# EAGLE design RHD2132_headstage_accel_mini (EAGLE 8.3.2)
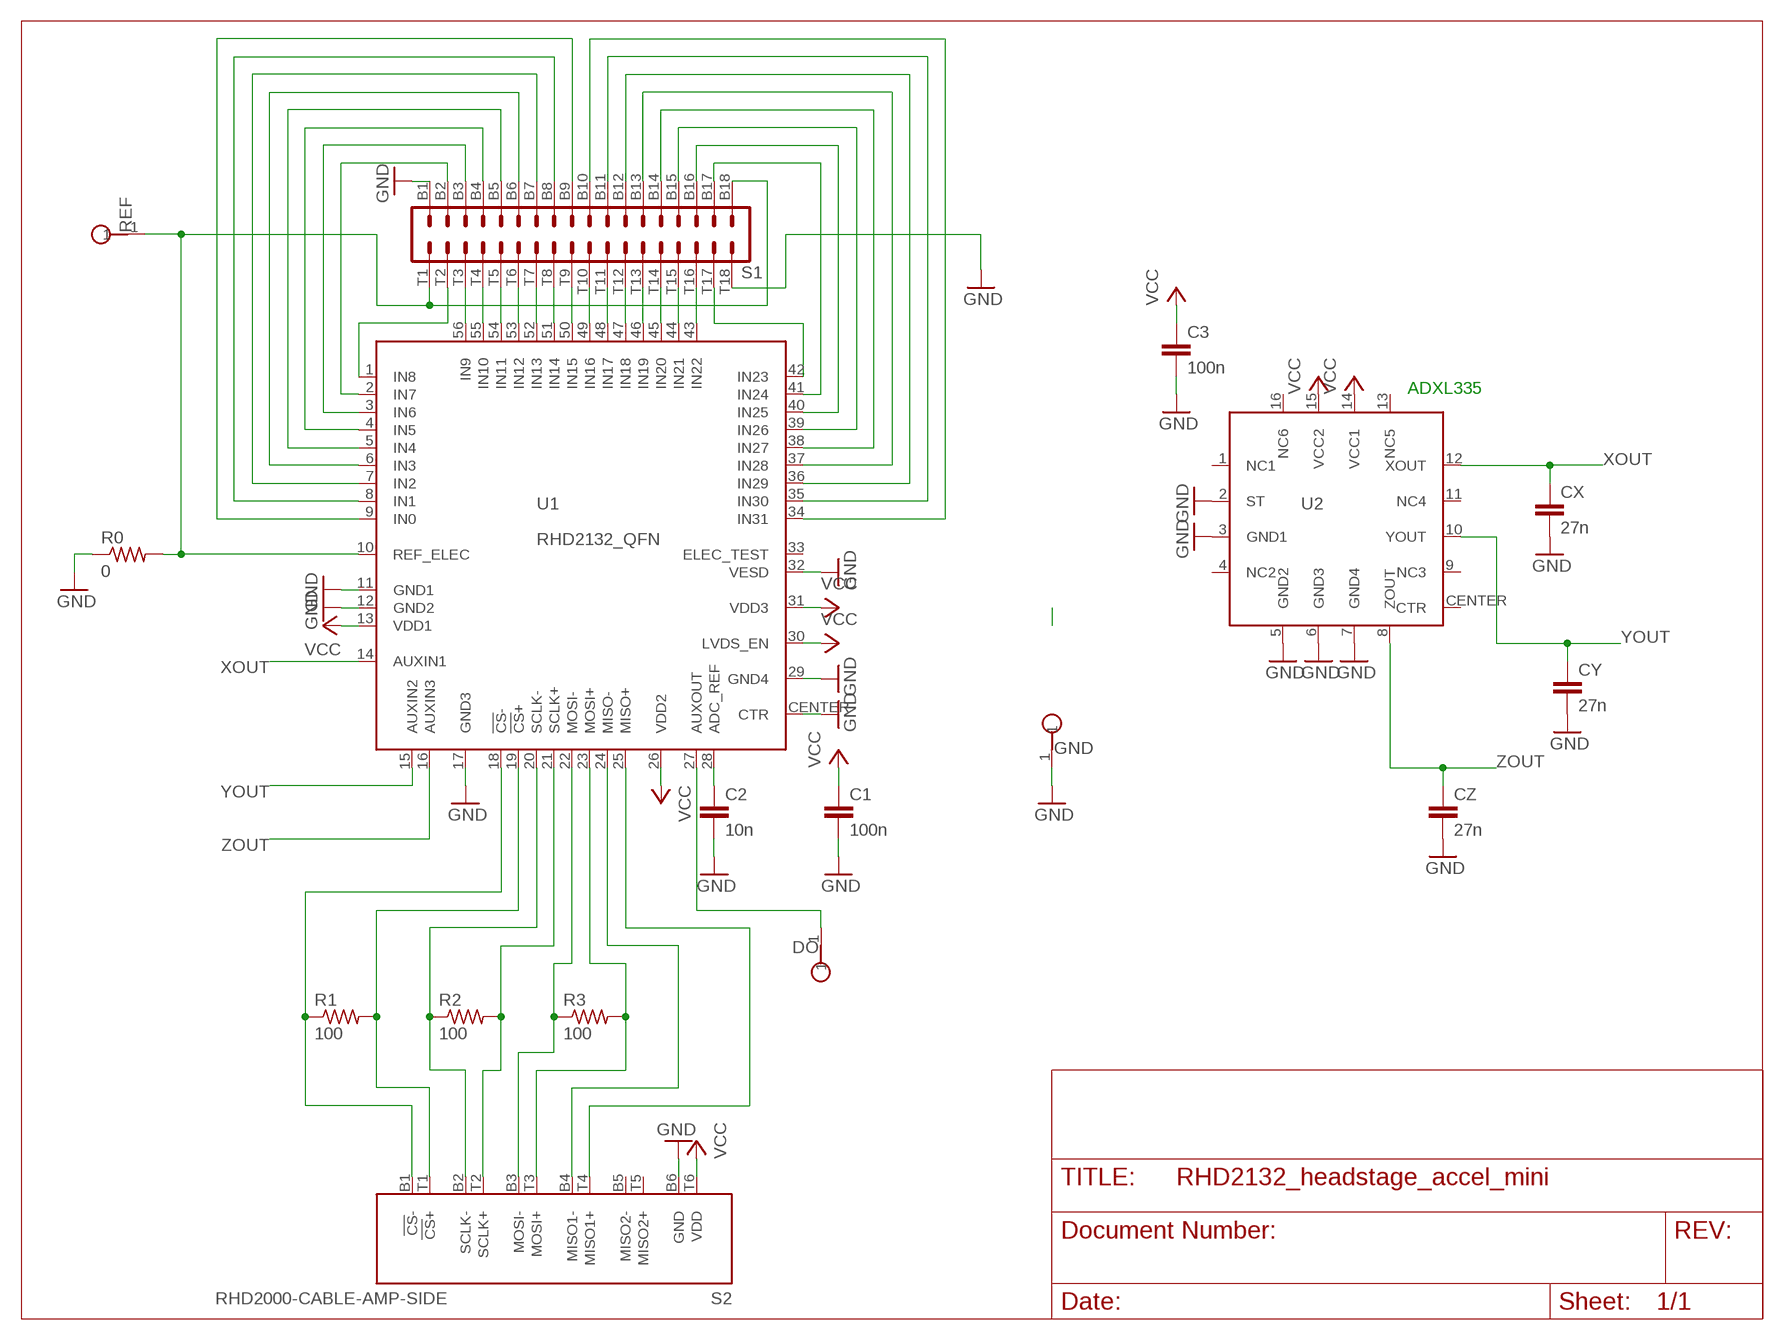
[diagram p0: schematic, sheet 1]

## Parts
C1  100n  C_0201  [0201]
C2  10n  C_0201  [0201]
C3  100n  C_0201  [0201]
CX  27n  C_0201  [0201]
CY  27n  C_0201  [0201]
CZ  27n  C_0201  [0201]
DO  TESTPOINT_SMALL  [TESTPOINT_SMALL]
GND  TESTPOINT_SMALL  [TESTPOINT_SMALL]
R0  0  R_0201  [0201]
R1  100  R_0201  [0201]
R2  100  R_0201  [0201]
R3  100  R_0201  [0201]
REF  TESTPOINT_SMALL  [TESTPOINT_SMALL]
S1  OMNETICS_A79025  [OMNETICS_A79025]
S2  RHD2000-CABLE-AMP-SIDE  [OMNETICS_PZN-12-AA]
U1  RHD2132_QFN  [QFN56_8_X_8_LARGE]
U2  ADXL335  [ADXL335]

## Nets
GND: C1.2 C2.2 C3.2 CX.2 CY.2 CZ.2 GND.1 R0.1 S1.B1 S1.T18 S2.B6(GND) U1.11(GND1) U1.12(GND2) U1.17(GND3) U1.29(GND4) U1.32(VESD) U1.CENTER(CTR) U2.2(ST) U2.3(GND1) U2.5(GND2) U2.6(GND3) U2.7(GND4)
N$1: R0.2 REF.1 S1.B18 S1.T1 U1.10(REF_ELEC)
N$2: S1.B3 U1.3(IN6)
N$3: S1.B2 U1.2(IN7)
N$4: S1.B4 U1.4(IN5)
N$5: S1.B5 U1.5(IN4)
N$6: S1.B6 U1.6(IN3)
N$7: S1.B7 U1.7(IN2)
N$8: S1.B8 U1.8(IN1)
N$9: S1.B9 U1.9(IN0)
N$10: S1.B10 U1.34(IN31)
N$11: R1.1 S2.B1(!CS!-) U1.18(!CS!-)
N$12: S1.B17 U1.41(IN24)
N$13: S1.B16 U1.40(IN25)
N$14: S1.B15 U1.39(IN26)
N$15: S1.B14 U1.38(IN27)
N$16: S1.B13 U1.37(IN28)
N$17: S1.B12 U1.36(IN29)
N$18: S1.B11 U1.35(IN30)
N$19: S1.T9 U1.50(IN15)
N$20: S1.T8 U1.51(IN14)
N$21: S1.T7 U1.52(IN13)
N$22: S1.T3 U1.56(IN9)
N$23: S1.T4 U1.55(IN10)
N$24: S1.T5 U1.54(IN11)
N$25: S1.T6 U1.53(IN12)
N$26: S1.T10 U1.49(IN16)
N$27: S1.T11 U1.48(IN17)
N$28: S1.T12 U1.47(IN18)
N$29: S1.T13 U1.46(IN19)
N$30: S1.T14 U1.45(IN20)
N$31: S1.T15 U1.44(IN21)
N$32: S1.T16 U1.43(IN22)
N$33: S1.T2 U1.1(IN8)
N$34: S1.T17 U1.42(IN23)
N$35: R1.2 S2.T1(!CS!+) U1.19(!CS!+)
N$36: R2.1 S2.B2(SCLK-) U1.20(SCLK-)
N$37: R2.2 S2.T2(SCLK+) U1.21(SCLK+)
N$38: R3.1 S2.B3(MOSI-) U1.22(MOSI-)
N$39: R3.2 S2.T3(MOSI+) U1.23(MOSI+)
N$40: S2.B4(MISO1-) U1.24(MISO-)
N$41: S2.T4(MISO1+) U1.25(MISO+)
N$42: C2.1 U1.28(ADC_REF)
N$43: DO.1 U1.27(AUXOUT)
VCC: C1.1 C3.1 S2.T6(VDD) U1.13(VDD1) U1.26(VDD2) U1.30(LVDS_EN) U1.31(VDD3) U2.14(VCC1) U2.15(VCC2)
XOUT: CX.1 U1.14(AUXIN1) U2.12(XOUT)
YOUT: CY.1 U1.15(AUXIN2) U2.10(YOUT)
ZOUT: CZ.1 U1.16(AUXIN3) U2.8(ZOUT)
Unconnected: S2.B5(MISO2-) S2.T5(MISO2+) U1.33(ELEC_TEST) U2.1(NC1) U2.4(NC2) U2.9(NC3) U2.11(NC4) U2.13(NC5) U2.16(NC6) U2.CENTER(CTR)

## Notes on the sheet
- ADXL335

## Library data of the parts
C1-C3 CX CY CZ = RHD2000_eval_board:C: Capacitor
DO GND REF = RHD2000_eval_board:TESTPOINT: PCB Test Point
R0 R1-R3 = RHD2000_eval_board:R: Resistor
S1 = RHD2000:OMNETICS_A79025
S2 = RHD2000:RHD2000-CABLE-AMP-SIDE
U1 = RHD2000:RHD2132
U2 = harrison:ADXL335

## Net classes
1 thick: width 1.016 mm
2 power: width 0.61 mm

## Board
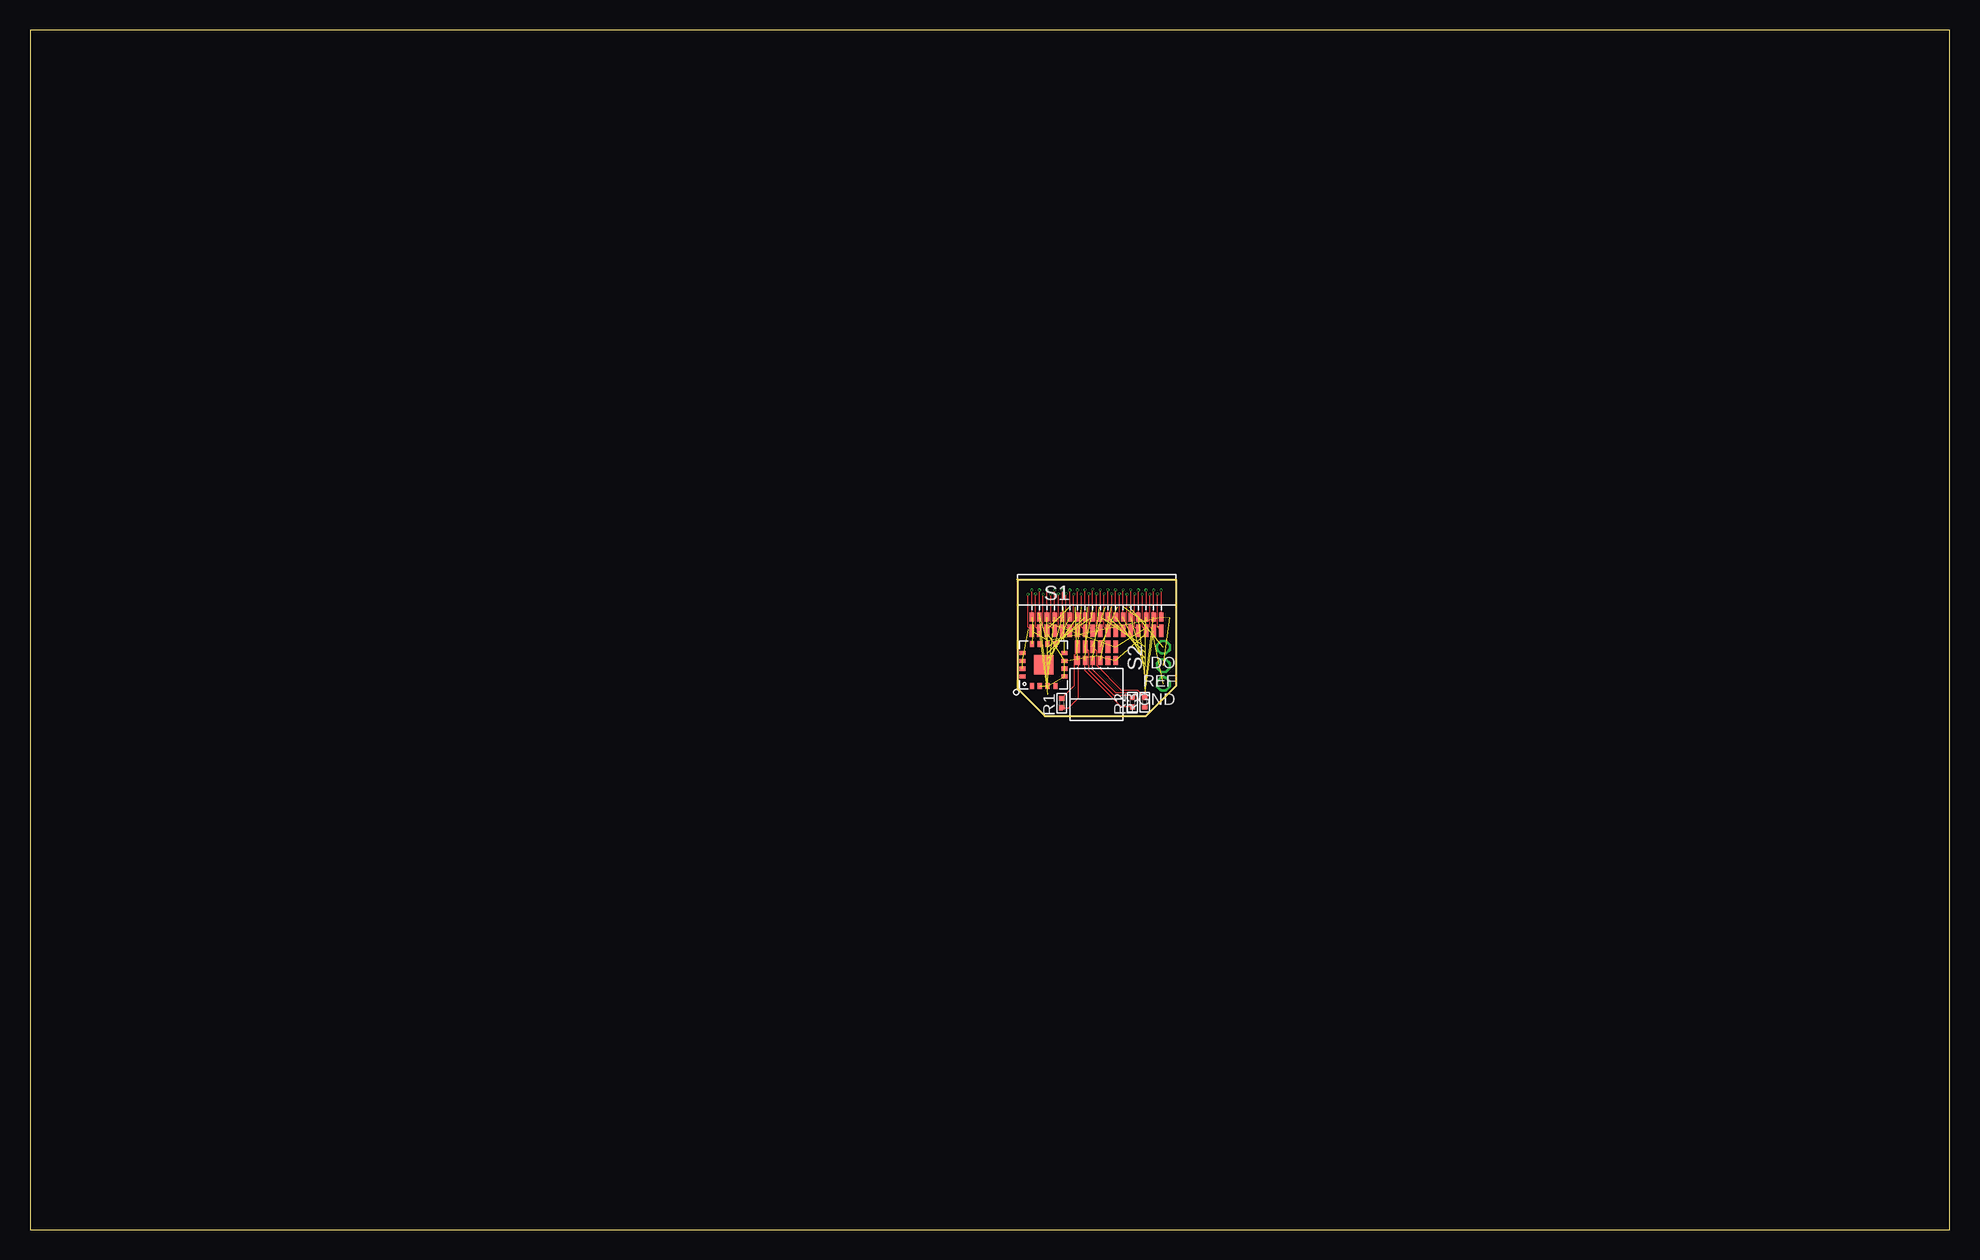
[diagram p1: board, top side]
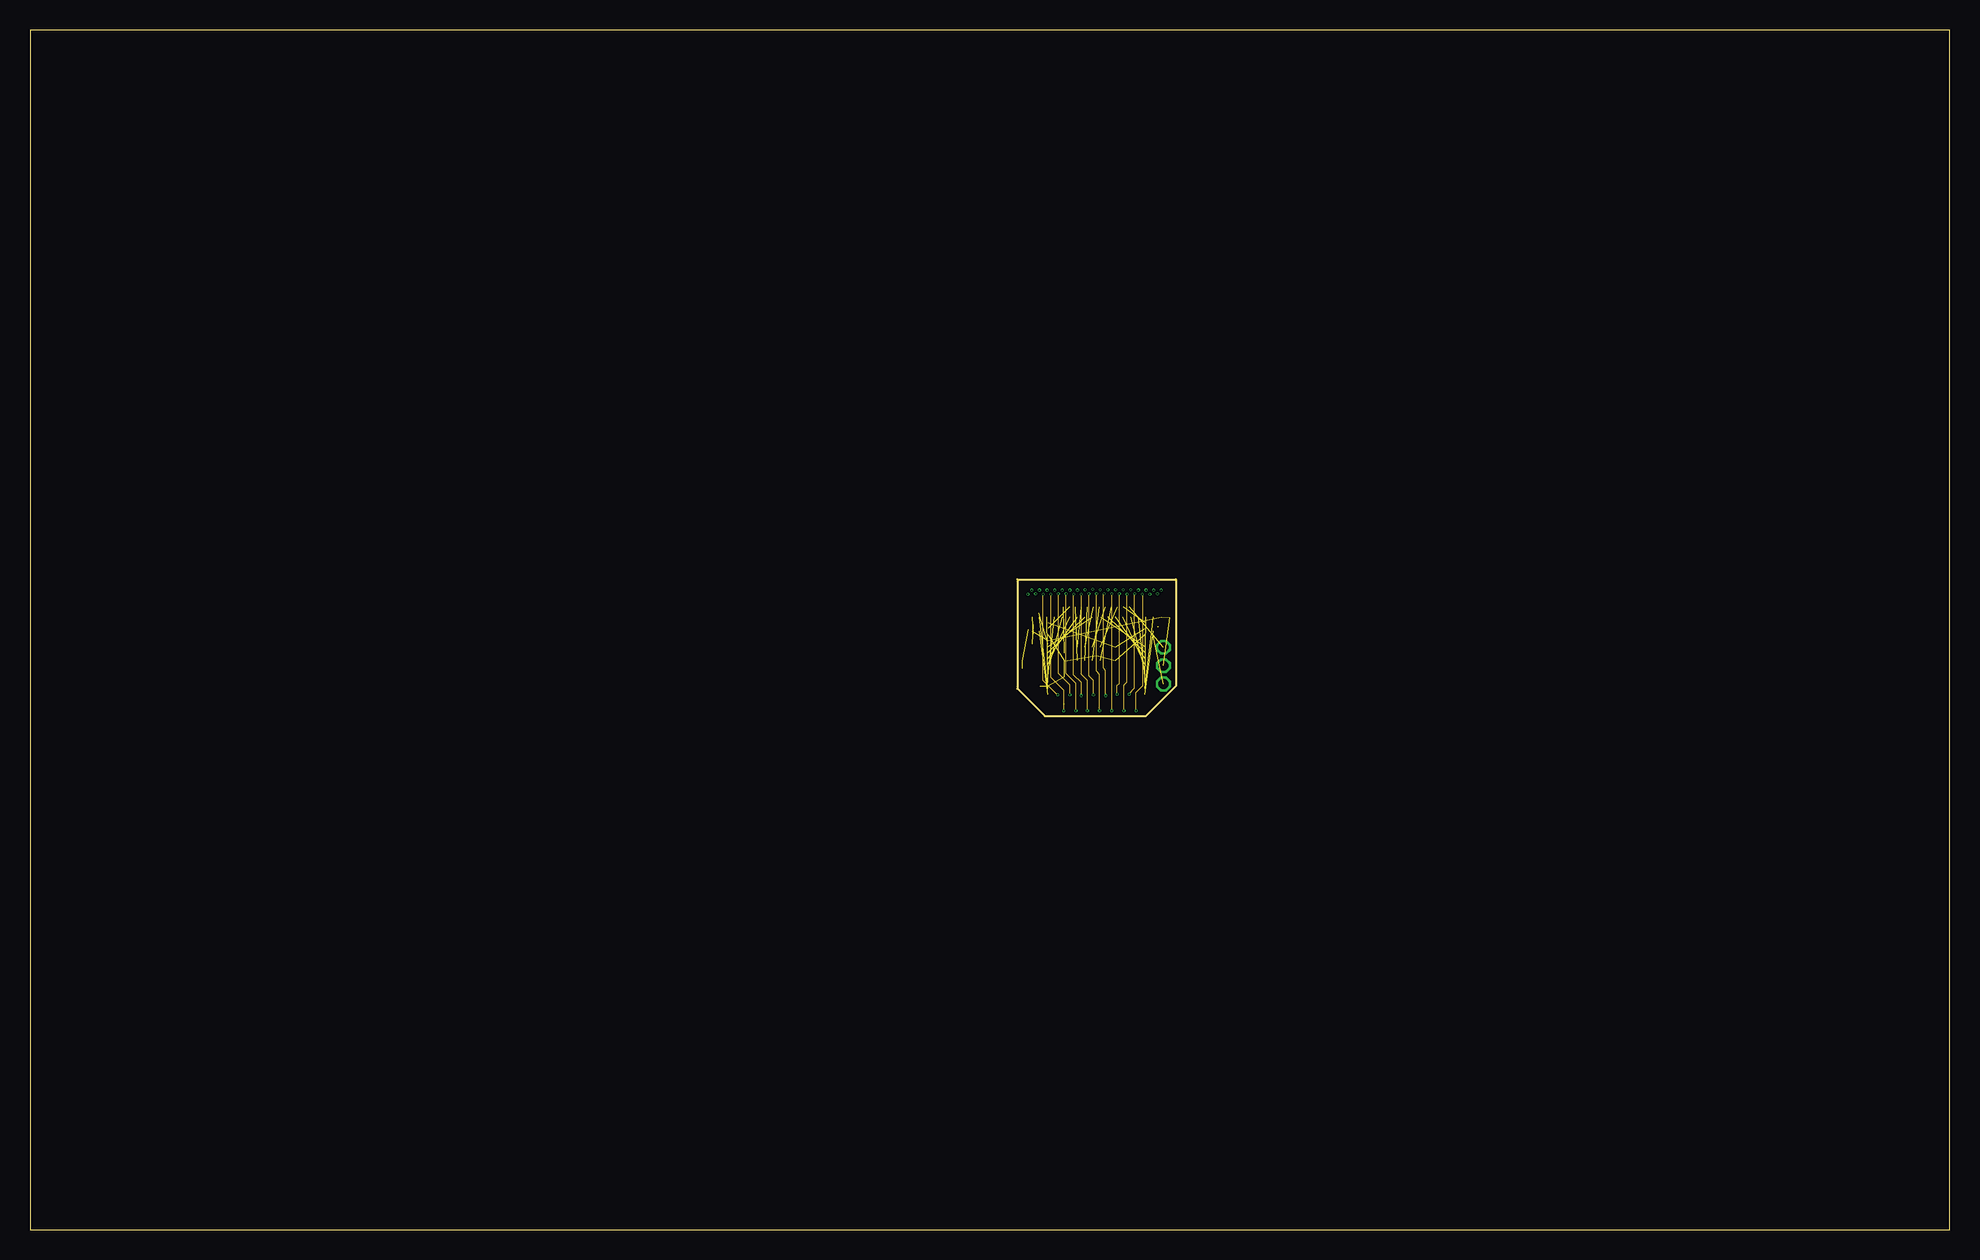
[diagram p2: board, inner layer Route15]
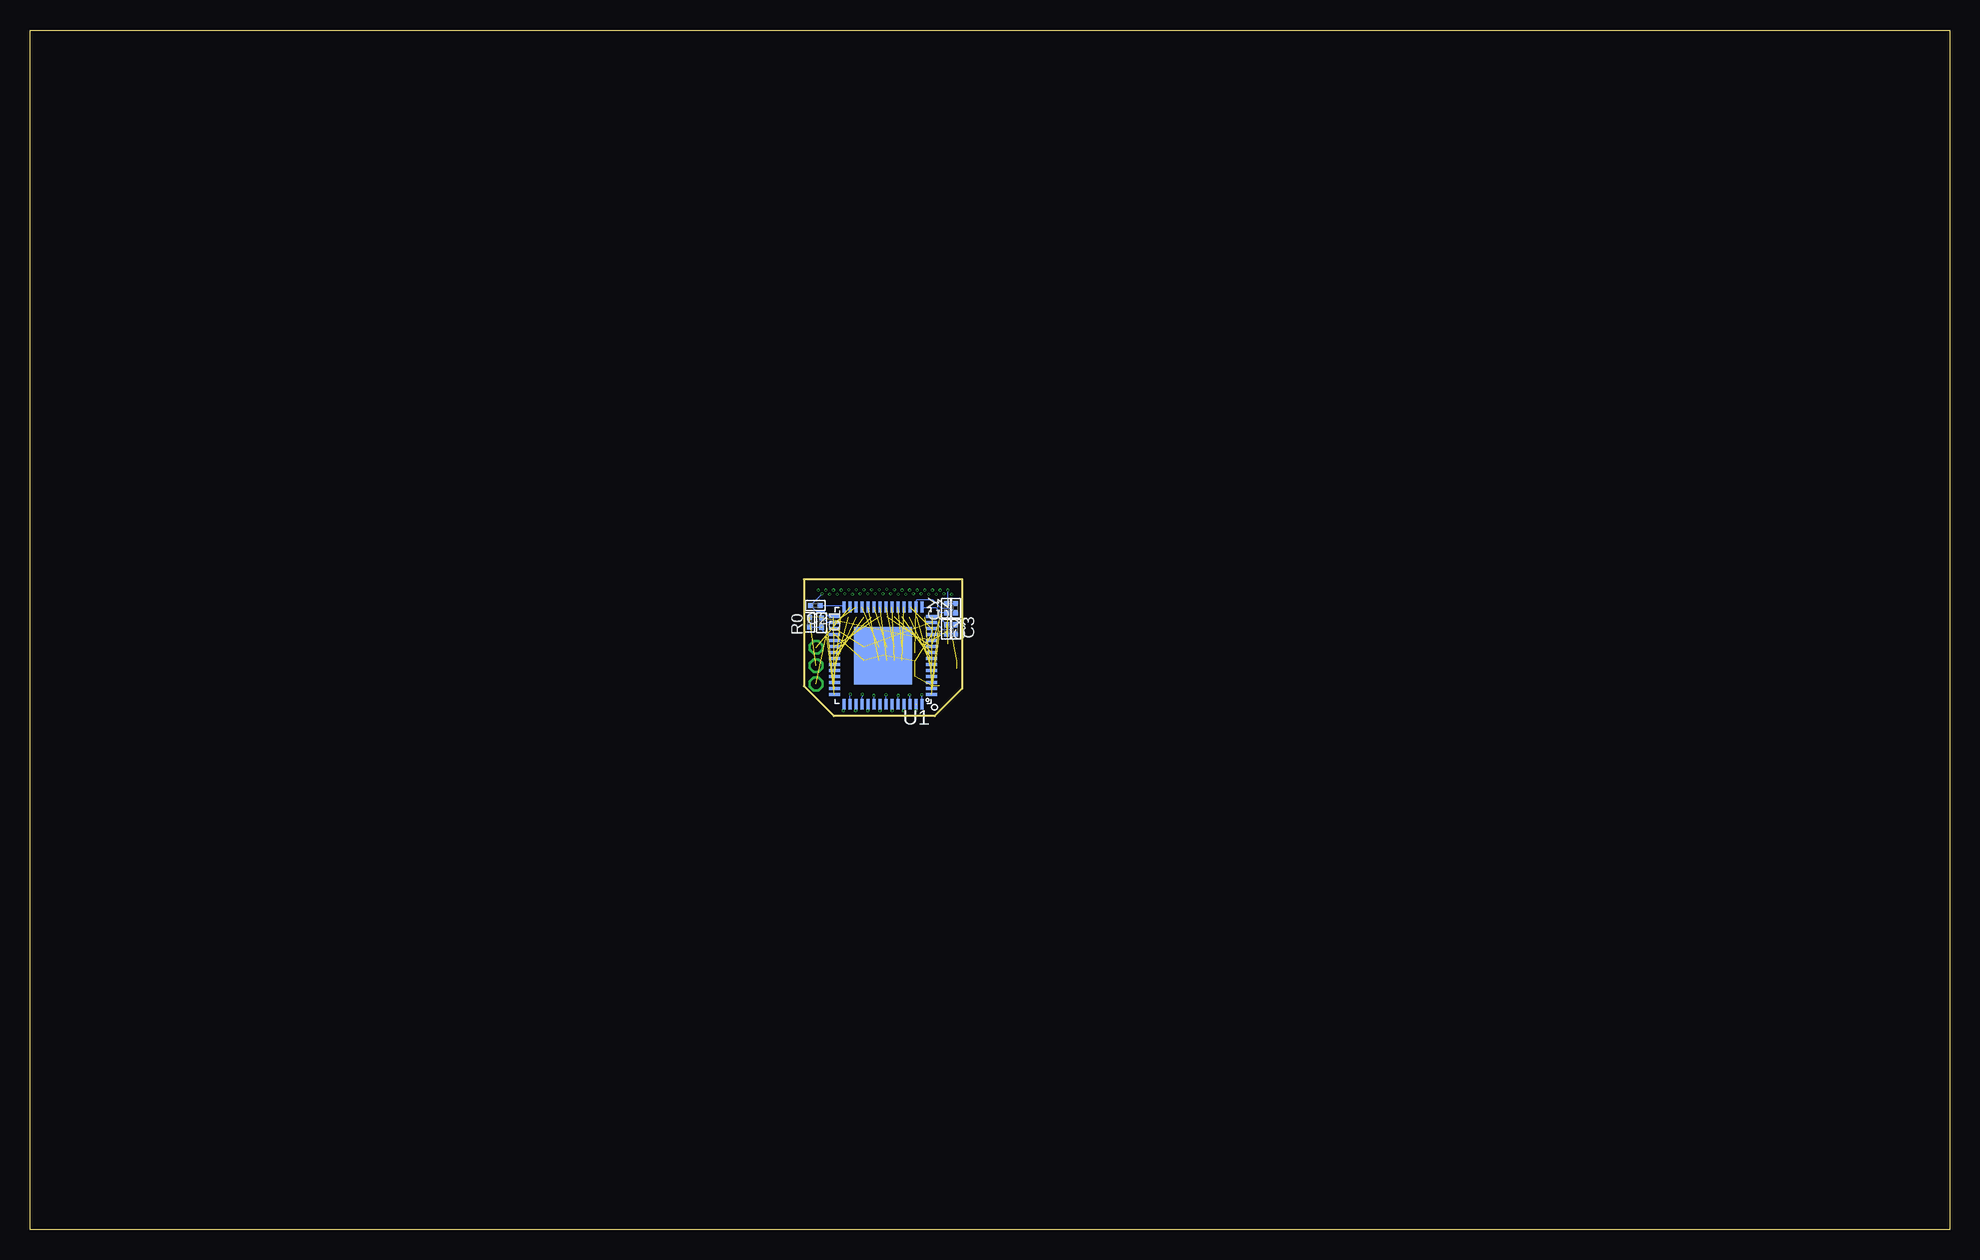
[diagram p3: board, bottom side, seen from below]

Size 160 x 100 mm. Coordinates in mm from the lower left corner, seen from the top.
Outline: 0,0 160,0 160,100 0,100 0,0
Outline: 82.3,54.2 82.3,45.1 84.6,42.8 93,42.8 95.5,45.3 95.5,54.2 82.3,54.2
Copper layers ((1*2)+(15*16)): Top 0.035mm / dielectric 1.5mm / Route2 0.035mm / dielectric 0.15mm / Route15 0.035mm / dielectric 0.2mm / Bottom 0.035mm
Design rules "default *": minimum track width 6mil, minimum drill 0.1mm, track to track 2mil, track to pad 2mil, pad to pad 2mil, via to via 2mil, smd to smd 2mil, copper to edge 10mil, drill to drill 6mil, minimum pad ring 2mil, minimum via ring 2mil, stop-mask expansion 4mil, vias tented up to drill 0mil, thermal gap 10mil

### Footprints (pad centres in the part's own frame; a part is rotated, then mirrored left to right if it is on the bottom)
0201 = smd 0.432 x 0.432: 1 -0.394,0; 2 0.394,0
TESTPOINT_SMALL = drill 0.813 octagon: 1 0,0
OMNETICS_A79025 = smd 0.381 x 0.762: B1 -5.397,-1.016; B2 -4.763,-1.016; B3 -4.128,-1.016; B4 -3.493,-1.016; B5 -2.857,-1.016; B6 -2.223,-1.016; B7 -1.587,-1.016; B8 -0.953,-1.016; B9 -0.318,-1.016; B10 0.318,-1.016; B11 0.953,-1.016; B12 1.587,-1.016; B13 2.223,-1.016; B14 2.857,-1.016; B15 3.493,-1.016; B16 4.128,-1.016; B17 4.763,-1.016; B18 5.397,-1.016 | smd 0.381 x 1.016: T1 -5.397,-2.159; T2 -4.763,-2.159; T3 -4.128,-2.159; T4 -3.493,-2.159; T5 -2.857,-2.159; T6 -2.223,-2.159; T7 -1.587,-2.159; T8 -0.953,-2.159; T9 -0.318,-2.159; T10 0.318,-2.159; T11 0.953,-2.159; T12 1.587,-2.159; T13 2.223,-2.159; T14 2.857,-2.159; T15 3.493,-2.159; T16 4.128,-2.159; T17 4.763,-2.159; T18 5.397,-2.159
OMNETICS_PZN-12-AA = smd 0.381 x 0.762: B1 1.587,-1.016; B2 0.953,-1.016; B3 0.318,-1.016; B4 -0.318,-1.016; B5 -0.953,-1.016; B6 -1.587,-1.016 | smd 0.381 x 1.016: T1 1.587,-2.159; T2 0.953,-2.159; T3 0.318,-2.159; T4 -0.318,-2.159; T5 -0.953,-2.159; T6 -1.587,-2.159
QFN56_8_X_8_LARGE = smd 0.9 x 0.25: 1 -4.05,3.25; 2 -4.05,2.75; 3 -4.05,2.25; 4 -4.05,1.75; 5 -4.05,1.25; 6 -4.05,0.75; 7 -4.05,0.25; 8 -4.05,-0.25; 9 -4.05,-0.75; 10 -4.05,-1.25; 11 -4.05,-1.75; 12 -4.05,-2.25; 13 -4.05,-2.75; 14 -4.05,-3.25; 29 4.05,-3.25; 30 4.05,-2.75; 31 4.05,-2.25; 32 4.05,-1.75; 33 4.05,-1.25; 34 4.05,-0.75; 35 4.05,-0.25; 36 4.05,0.25; 37 4.05,0.75; 38 4.05,1.25; 39 4.05,1.75; 40 4.05,2.25; 41 4.05,2.75; 42 4.05,3.25 | smd 0.25 x 0.9: 15 -3.25,-4.05; 16 -2.75,-4.05; 17 -2.25,-4.05; 18 -1.75,-4.05; 19 -1.25,-4.05; 20 -0.75,-4.05; 21 -0.25,-4.05; 22 0.25,-4.05; 23 0.75,-4.05; 24 1.25,-4.05; 25 1.75,-4.05; 26 2.25,-4.05; 27 2.75,-4.05; 28 3.25,-4.05; 43 3.25,4.05; 44 2.75,4.05; 45 2.25,4.05; 46 1.75,4.05; 47 1.25,4.05; 48 0.75,4.05; 49 0.25,4.05; 50 -0.25,4.05; 51 -0.75,4.05; 52 -1.25,4.05; 53 -1.75,4.05; 54 -2.25,4.05; 55 -2.75,4.05; 56 -3.25,4.05 | smd 4.8 x 4.8: CENTER 0,0
ADXL335 = smd 0.5 x 0.35: 1 -1.75,0.975; 2 -1.75,0.325; 3 -1.75,-0.325; 4 -1.75,-0.975; 9 1.75,-0.975; 10 1.75,-0.325; 11 1.75,0.325; 12 1.75,0.975 | smd 0.35 x 0.5: 5 -0.975,-1.75; 6 -0.325,-1.75; 7 0.325,-1.75; 8 0.975,-1.75; 13 0.975,1.75; 14 0.325,1.75; 15 -0.325,1.75; 16 -0.975,1.75 | smd 1.6 x 1.6: CENTER 0,0

### Placement (x,y rotation side)
C1  94.03,50.6 270 bottom
C2  94.54,52.02 180 bottom
C3  82.85,50.03 270 bottom
CX  83.61,50.03 270 bottom
CY  83.61,51.8 90 bottom
CZ  82.85,51.8 90 bottom
DO  94.48,48.53 180 top
GND  94.48,45.48 180 top
R0  95.01,50.62 90 bottom
R1  86,43.89 90 top
R2  91.9,43.95 90 top
R3  92.92,43.95 90 top
REF  94.48,47.01 180 top
S1  88.9,52.07 0 top
S2  88.9,46.42 180 top
U1  88.9,47.84 180 bottom
U2  84.5,47.08 90 top

### Tracks (layer width: path | path; a pad name or v marks a point on that pad's centre or on a via)
GND  (via drill 0.13)  (12 unrouted)
  Top 0.051: S1.T18 93.98,50.23 v93.98,52.99 | S1.B1 83.5,53.08 83.51,53.08 v83.51,53.31
  Bottom 0.102: 84.85,49.66 U1.11 | 84.85,49.66 U1.12 | 83.5,52.2 CY.2 | 83.5,52.2 CZ.2 | v83.51,53.31 83.51,52.2 83.5,52.2 | C3.2 CX.2 84.83,49.63 84.85,49.66 | v93.98,52.99 94.93,52.04 C2.2 94.41,51.5 93.79,51.5 93.38,51.09 U1.29 | R0.1 94.05,50.23 C1.2 94.03,50.02 93.6,49.59 U1.32
N$1  (via drill 0.13)  (4 unrouted)
  Top 0.051: S1.B18 94.3,52.96 94.29,52.96 v94.29,53.31 | S1.T1 83.19,50.23 v83.19,52.96
N$2  (via drill 0.13)  (1 unrouted)
  Top 0.051: S1.B3 v84.77,53.31 84.77,53.4
N$3  (via drill 0.13)  (1 unrouted)
  Top 0.051: S1.B2 v84.14,53.31 84.14,53.08
N$4  (via drill 0.13)  (1 unrouted)
  Top 0.051: S1.B4 v85.41,53.31 85.41,53.02
N$5  (via drill 0.13)  (1 unrouted)
  Top 0.051: S1.B5 v86.04,53.31 86.04,53.08
N$6  (via drill 0.13)  (1 unrouted)
  Top 0.051: S1.B6 v86.68,53.31 86.68,53.08
N$7  (via drill 0.13)  (1 unrouted)
  Top 0.051: S1.B7 v87.31,53.31 87.31,53.08
N$8  (via drill 0.13)  (1 unrouted)
  Top 0.051: S1.B8 v87.95,53.34
N$9  (via drill 0.13)  (1 unrouted)
  Top 0.051: S1.B9 v88.58,53.37
N$10  (via drill 0.13)  (1 unrouted)
  Top 0.051: S1.B10 v89.22,53.34 89.22,53.28
N$11  (1 unrouted)
  Top 0.102: R1.1 86.55,43.5 87.38,44.32 87.38,47.37 S2.B1
N$12  (via drill 0.13)  (1 unrouted)
  Top 0.051: S1.B17 v93.66,53.31 93.66,53.02
N$13  (via drill 0.13)  (1 unrouted)
  Top 0.051: S1.B16 v93.03,53.31 93.03,53.34
N$14  (via drill 0.13)  (1 unrouted)
  Top 0.051: S1.B15 v92.39,53.31 92.39,53.08
N$15  (via drill 0.13)  (1 unrouted)
  Top 0.051: S1.B14 v91.76,53.34
N$16  (via drill 0.13)  (1 unrouted)
  Top 0.051: S1.B13 v91.12,53.34
N$17  (via drill 0.13)  (1 unrouted)
  Top 0.051: S1.B12 v90.49,53.34
N$18  (via drill 0.13)  (1 unrouted)
  Top 0.051: S1.B11 v89.85,53.34 89.85,52.77
N$19  (via drill 0.13, 0.13 layers 15-16)
  Top 0.051: S1.T9 88.27,50.23 v88.27,52.99
  Route15 0.102: v88.65,44.58 88.65,45.78 88.27,46.16 v88.27,52.99
  Bottom 0.102: U1.50 88.65,44.38 88.65,44.39 v88.65,44.58
N$20  (via drill 0.13, 0.13 layers 15-16)
  Top 0.051: S1.T8 87.63,50.23 v87.63,52.96
  Route15 0.102: v88.14,43.24 88.14,45.78 87.63,46.29 v87.63,52.96
  Bottom 0.102: U1.51 88.15,43.18 v88.15,43.23 v88.14,43.24
N$21  (via drill 0.13, 0.13 layers 15-16)
  Top 0.051: S1.T7 87,50.23 v87,52.96
  Route15 0.102: v87.63,44.51 87.63,45.59 87,46.23 v87,52.96
  Bottom 0.102: U1.52 87.65,44.37 87.63,44.39 v87.63,44.51
N$22  (via drill 0.13, 0.13 layers 15-16)
  Top 0.051: S1.T3 84.45,50.23 v84.45,52.96
  Route15 0.102: v85.66,44.58 84.45,45.78 v84.45,52.96
  Bottom 0.102: U1.56 85.66,43.8 v85.66,44.58
N$23  (via drill 0.13, 0.13 layers 15-16)  (1 unrouted)
  Top 0.051: S1.T4 85.09,50.23 v85.09,52.96
  Route15 0.102: v86.17,43.24 86.17,44.96 85.09,46.04 v85.09,52.96
  Bottom 0.102: 86.17,43.77 U1.55 | 86.17,43.82 v86.17,43.24
N$24  (via drill 0.13, 0.13 layers 15-16)
  Top 0.051: S1.T5 85.72,50.23 v85.72,52.99 | v85.72,52.99 85.72,53.08 v85.72,52.99
  Route15 0.102: v86.68,44.58 86.68,45.4 85.72,46.35 v85.72,52.99
  Bottom 0.102: U1.54 86.65,44.48 86.61,44.51 v86.68,44.58
N$25  (via drill 0.13, 0.13 layers 15-16)
  Top 0.051: S1.T6 86.36,50.23 v86.36,52.99 | v86.36,52.99 86.36,53.08 v86.36,52.99
  Route15 0.102: v87.19,43.24 87.19,45.53 86.36,46.35 v86.36,52.99
  Bottom 0.102: U1.53 87.15,43.18 87.15,43.21 v87.19,43.24
N$26  (via drill 0.13, 0.13 layers 15-16)
  Top 0.051: S1.T10 88.9,50.23 v88.9,52.99
  Route15 0.102: v89.15,43.24 89.15,46.29 88.9,46.55 v88.9,52.99
  Bottom 0.102: U1.49 89.15,43.18 v89.15,43.24
N$27  (via drill 0.13, 0.13 layers 15-16)
  Top 0.051: S1.T11 89.53,50.23 v89.53,52.99 | v89.53,52.99 89.53,53.08 v89.53,52.99
  Route15 0.102: v89.66,44.51 89.66,46.61 89.47,46.8 89.47,52.93 v89.53,52.99
  Bottom 0.102: U1.48 89.65,44.37 89.66,44.39 v89.66,44.51
N$28  (via drill 0.13, 0.13 layers 15-16)
  Top 0.051: S1.T12 90.17,50.23 v90.17,52.99 | v90.17,52.99 90.17,53.08 v90.17,52.99
  Route15 0.102: v90.17,43.24 v90.17,52.99
  Bottom 0.102: U1.47 90.15,43.2 90.17,43.18 v90.17,43.24
N$29  (via drill 0.13, 0.13 layers 15-16)
  Top 0.051: S1.T13 90.81,50.23 v90.81,52.99
  Route15 0.102: v90.61,44.63 90.61,45.34 90.81,45.53 v90.81,52.99
  Bottom 0.102: U1.46 90.65,44.41 90.61,44.45 v90.61,44.63
N$30  (via drill 0.13, 0.13 layers 15-16)
  Top 0.051: S1.T14 91.44,50.23 v91.44,52.96
  Route15 0.102: v91.19,43.24 91.19,45.4 91.44,45.66 v91.44,52.96
  Bottom 0.102: U1.45 91.15,43.28 v91.19,43.24
N$31  (via drill 0.13, 0.13 layers 15-16)
  Top 0.051: S1.T15 92.08,50.23 v92.08,52.99
  Route15 0.102: v91.63,44.63 91.63,44.7 92.08,45.15 v92.08,52.99
  Bottom 0.102: U1.44 91.65,44.49 91.63,44.51 v91.63,44.63
N$32  (via drill 0.13, 0.13 layers 15-16)
  Top 0.051: S1.T16 92.71,50.23 v92.71,52.96
  Route15 0.102: v92.2,43.24 92.2,44.77 92.77,45.34 92.77,52.9 v92.71,52.96
  Bottom 0.102: U1.43 92.15,43.23 92.2,43.18 v92.2,43.24
N$33  (via drill 0.13)  (1 unrouted)
  Top 0.051: S1.T2 83.82,50.23 v83.82,52.99 | v83.82,52.99 83.82,53.02 v83.82,52.99
N$34  (via drill 0.13)  (1 unrouted)
  Top 0.051: S1.T17 93.34,50.23 v93.34,52.96
N$35  (1 unrouted)
  Top 0.102: S2.T1 87.31,48.15 87.02,47.86 87.02,45.31 R1.2
N$36  (1 unrouted)
  Top 0.102: R2.1 91,43.56 87.95,46.61 S2.B2
N$37  (1 unrouted)
  Top 0.102: S2.T2 88.29,48.24 88.29,46.62 90.34,44.51 91.74,44.51 R2.2
N$38  (1 unrouted)
  Top 0.102: R3.1 92.28,44.26 92.28,44.6 92.16,44.73 90.53,44.73 88.58,46.67 S2.B3
N$39  (1 unrouted)
  Top 0.102: R3.2 92.95,44.35 92.35,44.94 90.99,44.94 88.92,47.01 88.92,48.24 S2.T3
N$40  (1 unrouted)
N$41  (1 unrouted)
N$42
  Bottom 0.102: C2.1 92.28,52.02 U1.28
N$43  (1 unrouted)
VCC  (5 unrouted)
  Bottom 0.102: U1.31 U1.30 92.97,50.61 93.53,50.61 93.92,50.99 C1.1 | U1.13 84.5,50.59 83.95,50.04 83.23,50.04 C3.1
XOUT  (1 unrouted)
  Bottom 0.102: U1.14 84.28,51.09 CX.1
YOUT  (1 unrouted)
  Bottom 0.102: CY.1 84.05,51.41 84.45,51.82 85.58,51.82 U1.15
ZOUT  (1 unrouted)
  Bottom 0.102: U1.16 86.15,52.41 86.04,52.51 84.77,52.51 84.07,51.82 83.25,51.82 CZ.1